# EAGLE design controller (EAGLE 6.2)
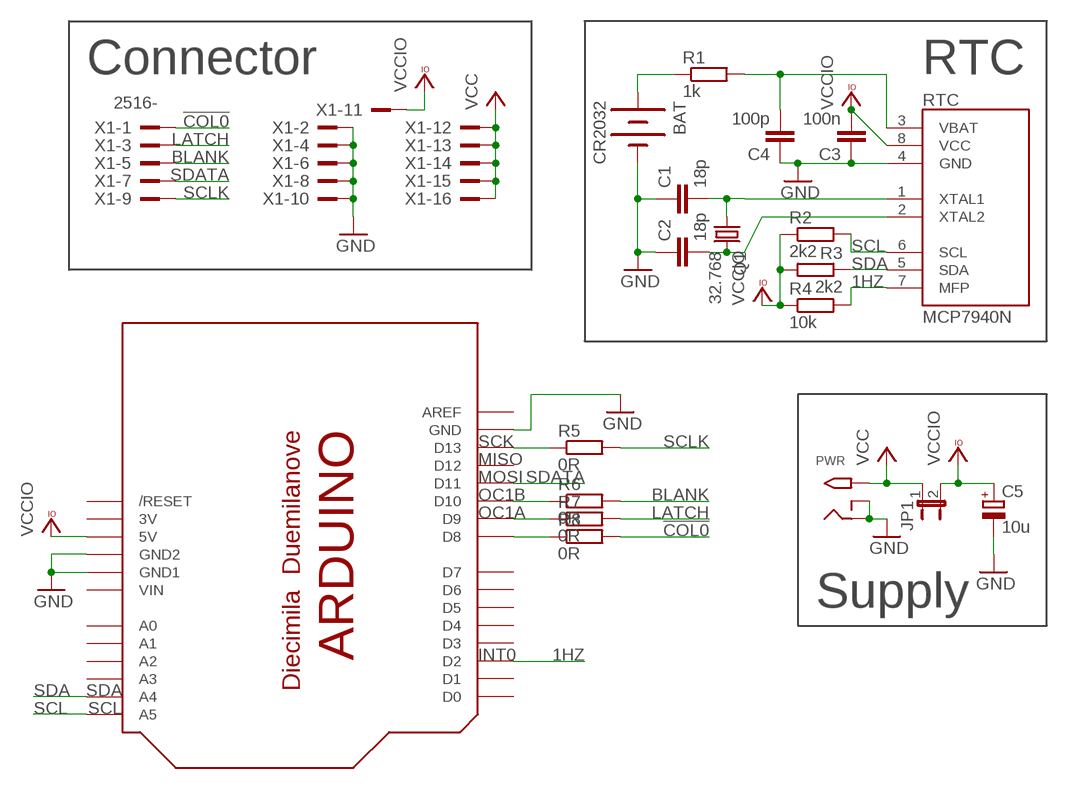
[diagram p0: schematic, sheet 1]

## Parts
ARDU  ARDUINODUEMILANOVE  [ARDUINO]
BAT  CR2032  [HAR-S8421]
C1  18p  C-EUC0603  [C0603]
C2  18p  C-EUC0603  [C0603]
C3  100n  C-EUC0603K  [C0603K]
C4  100p  C-EUC0603  [C0603]
C5  10u  CPOL-EUC/6032-28R  [C/6032-28R]
JP1  JP1E  [JP1]
PWR  2.1MMJACKTHM  [PJ-102A]
Q1  32.768  CRYSTALMM20SS  [MM20SS]
R1  1k  R-EU_R0603  [R0603]
R2  2k2  R-EU_R0603  [R0603]
R3  2k2  R-EU_R0603  [R0603]
R4  10k  R-EU_R0603  [R0603]
R5  0R  R-EU_R0603  [R0603]
R6  0R  R-EU_R0603  [R0603]
R7  0R  R-EU_R0603  [R0603]
R8  0R  R-EU_R0603  [R0603]
RTC  MCP7940N  [SO08]
X1  2516-  [PAK100/2500-16]

## Nets
1HZ: ARDU.D2 R4.2 RTC.7(MFP)
!COL0: R8.2 X1.1
BLANK: R6.2 X1.5
GND: ARDU.GND ARDU.GND1 ARDU.GND2 BAT.- C1.1 C2.1 C3.1 C4.1 C5.- PWR.RING PWR.RING_SW RTC.4(GND) X1.2 X1.4 X1.6 X1.8 X1.10
LATCH: R7.2 X1.3
N$1: C1.2 Q1.1 RTC.1(XTAL1)
N$2: C2.2 Q1.4 RTC.2(XTAL2)
N$3: BAT.+ R1.1
N$4: C4.2 R1.2 RTC.3(VBAT)
N$5: ARDU.D13 R5.1
N$6: ARDU.D10 R6.1
N$7: ARDU.D9 R7.1
N$8: ARDU.D8 R8.1
SCL: ARDU.A5 R2.2 RTC.6(SCL)
SCLK: R5.2 X1.9
SDA: ARDU.A4 R3.1 RTC.5(SDA)
SDATA: ARDU.D11 X1.7
VCC: JP1.1 PWR.TIP X1.12 X1.13 X1.14 X1.15 X1.16
VCCIO: ARDU.5V C3.2 C5.+ JP1.2 R2.1 R3.2 R4.1 RTC.8(VCC) X1.11
Unconnected: ARDU.A0 ARDU.A1 ARDU.A2 ARDU.A3 ARDU.AREF ARDU.D0 ARDU.D1 ARDU.D3 ARDU.D4 ARDU.D5 ARDU.D6 ARDU.D7 ARDU.D12 ARDU.RESET(/RESET)

## Notes on the sheet
- Connector
- RTC
- SCK
- MISO
- MOSI
- OC1B
- OC1A
- Supply
- INT0
- SDA
- SCL

## Power pins joined to a net without a drawn wire
3V: ARDU.3V
VIN: ARDU.VIN

## Library data of the parts
ARDU = adafruit:ARDUINO: Arduino Diecimila/Duemilanove Make a shield with ease, this package has all the named pins as well as the two mounting drill holes and an outline of the USB and DC power connector. The outline is on the DIMENSION layer, so if your board house uses it they will cut the outline to match. http://www.ladyada.net/library/pcb/eaglelibrary.html
BAT = jocki:CR2032
C1-C4 = rcl:C-EU: CAPACITOR, European symbol
C5 = rcl:CPOL-EU: POLARIZED CAPACITOR, European symbol
JP1 = jumper:JP1E: JUMPER
PWR = adafruit:2.1MMJACK: 2.1mm x 5.5mm THM DC jack with internal switch. Digikey part #PJ-102A, 4UCON part #05537 2.1mm x 5.5mm SMT DC jack with internal switch. Digikey part #PJ-002A-SMT, 4UCON part #03267 By microbuilder.eu & adafruit.com
Q1 = crystal:CRYSTAL: CRYSTAL; OC_FARNELL: unknown; OC_NEWARK: unknown
R1-R8 = rcl:R-EU_: RESISTOR, European symbol
RTC = jocki:MCP7940N
X1 = con-3m:2516-: 3M (TM) Pak 100 4-Wall Header Source: 3M; OC_FARNELL: unknown; OC_NEWARK: unknown

## Board
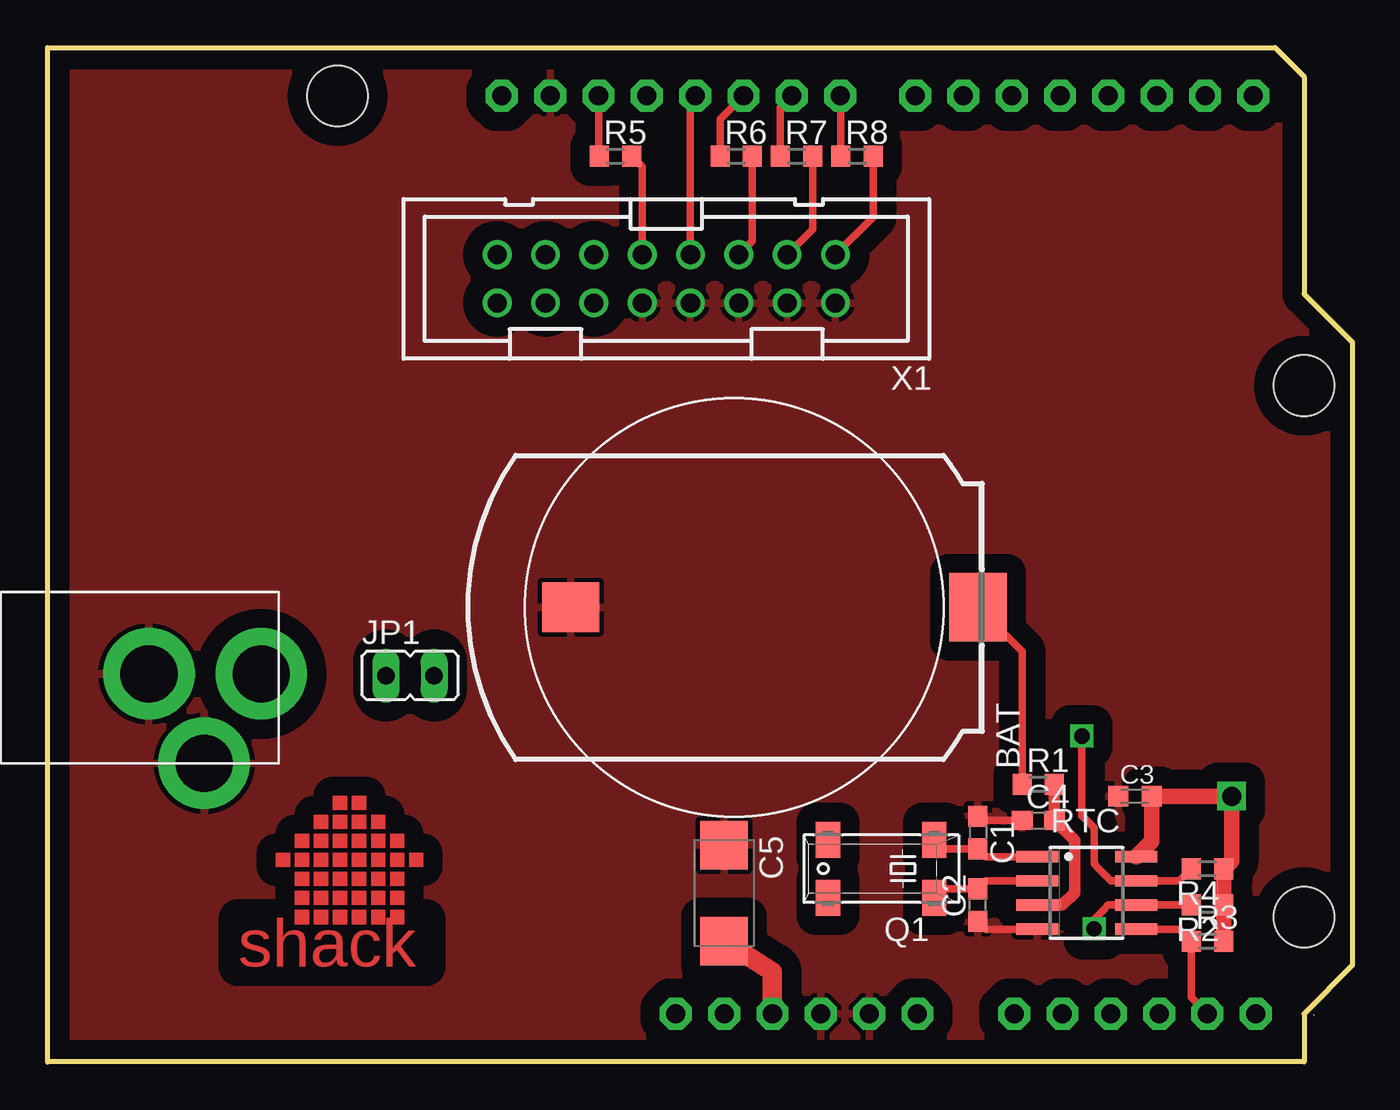
[diagram p1: board, top side]
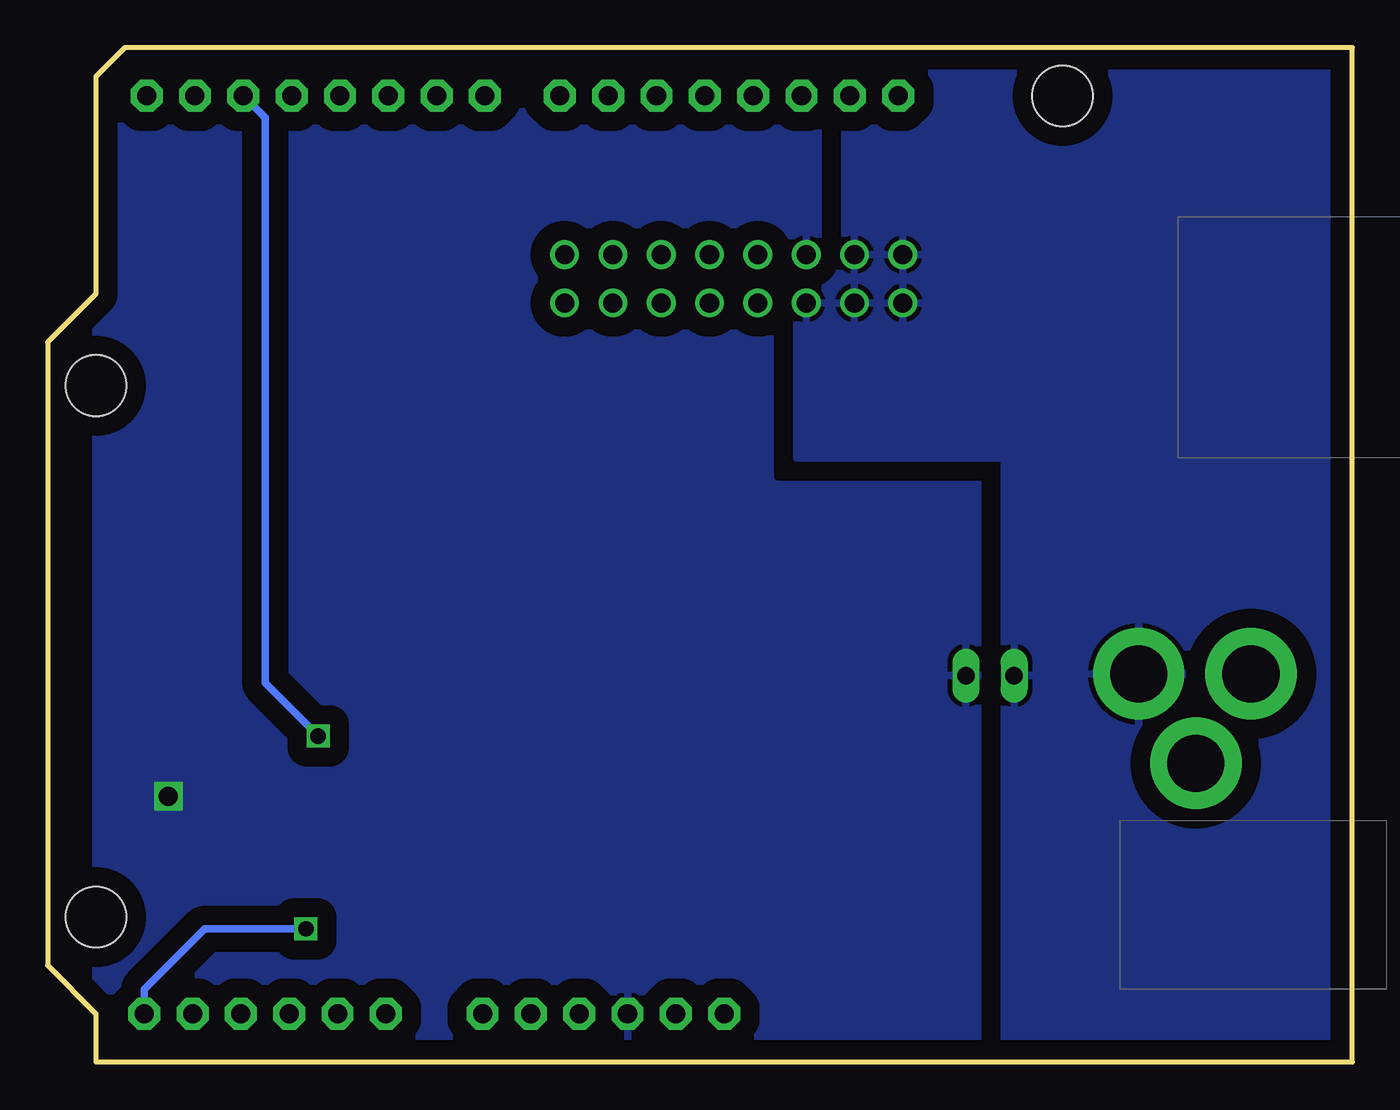
[diagram p2: board, bottom side, seen from below]

Size 68.58 x 53.34 mm. Coordinates in mm from the lower left corner, seen from the top.
Copper layers (1*16): Top 0.035mm / dielectric 1.5mm / Bottom 0.035mm
Design rules: minimum track width 10mil, minimum drill 24mil, track to track 8mil, track to pad 8mil, pad to pad 8mil, via to via 8mil, smd to smd 8mil, copper to edge 40mil, drill to drill 8mil, minimum pad ring 10mil, minimum via ring 8mil, stop-mask expansion 4mil, vias tented up to drill 0mil, thermal gap 10mil

### Footprints (pad centres in the part's own frame; a part is rotated, then mirrored left to right if it is on the bottom)
ARDUINO = drill 1 pad 1.676 octagon: 3V 35.56,2.54; 5V 38.1,2.54; A0 50.8,2.54; A1 53.34,2.54; A2 55.88,2.54; A3 58.42,2.54; A4 60.96,2.54; A5 63.5,2.54; AREF 23.876,50.8; D0 63.373,50.8; D1 60.833,50.8; D2 58.293,50.8; D3 55.753,50.8; D4 53.213,50.8; D5 50.673,50.8; D6 48.133,50.8; D7 45.593,50.8; D8 41.656,50.8; D9 39.116,50.8; D10 36.576,50.8; D11 34.036,50.8; D12 31.496,50.8; D13 28.956,50.8; GND 26.416,50.8; GND1 43.18,2.54; GND2 40.64,2.54; RESET 33.02,2.54; VIN 45.72,2.54 | hole 3.2: 66.04,35.56; 66.04,7.62; 15.24,50.8
HAR-S8421 = smd 3.6 x 3: + 0,-12.8 | smd 2.6 x 3: - 0,8.6
C0603 = smd 1.1 x 1: 1 -0.85,0; 2 0.85,0
C0603K = smd 1.05 x 1.08: 1 -0.875,0; 2 0.875,0
C/6032-28R = smd 2.55 x 2.5: + 2.525,0; - -2.525,0
JP1 = drill 0.914 long: 1 0,-1.27; 2 0,1.27
PJ-102A = drill 3 pad 4.8: RING 0.1,-3.39; RING_SW -4.6,-6.29; TIP 0.1,-9.29
MM20SS = smd 1.27 x 1.88: 1 -2.794,-1.524; 2 2.794,-1.524; 3 2.794,1.524; 4 -2.794,1.524
R0603 = smd 1 x 1.1: 1 -0.85,0; 2 0.85,0
SO08 = smd 0.6 x 2.2: 1 -1.905,-2.6; 2 -0.635,-2.6; 3 0.635,-2.6; 4 1.905,-2.6; 5 1.905,2.6; 6 0.635,2.6; 7 -0.635,2.6; 8 -1.905,2.6
PAK100/2500-16 = drill 1 pad 1.422: 1 -8.89,-1.27; 2 -8.89,1.27; 3 -6.35,-1.27; 4 -6.35,1.27; 5 -3.81,-1.27; 6 -3.81,1.27; 7 -1.27,-1.27; 8 -1.27,1.27; 9 1.27,-1.27; 10 1.27,1.27; 11 3.81,-1.27; 12 3.81,1.27; 13 6.35,-1.27; 14 6.35,1.27; 15 8.89,-1.27; 16 8.89,1.27

### Placement (x,y rotation side)
ARDU  0,0 0 top
BAT  36.1,23.9 90 top
C1  48.9,12.06 270 top
C2  48.9,8.26 90 top
C3  57.15,13.97 0 top
C4  52.07,12.7 0 top
C5  35.56,8.89 270 top
JP1  19.05,20.32 270 top
PWR  1.94,20.31 90 top
Q1  43.81,10.16 180 top
R1  52.07,14.61 0 top
R2  60.96,8.26 180 top
R3  60.96,6.35 0 top
R4  60.96,10.16 180 top
R5  29.84,47.62 0 top
R6  36.2,47.62 0 top
R7  39.37,47.62 0 top
R8  42.55,47.62 0 top
RTC  54.61,8.89 270 top
X1  32.52,41.18 180 top

### Tracks (layer width: path | path; a pad name or v marks a point on that pad's centre or on a via)
1HZ  (via drill 0.8)
  Top 0.406: R4.2 59.48,9.53 RTC.7 55.88,9.53 55.24,10.16 55,10.4 55,12.31 54.61,12.7 54.37,12.95 v54.37,17.14
  Bottom 0.406: v54.37,17.14 57.15,19.92 57.15,24.13 57.15,49.66 ARDU.D2
!COL0
  Top 0.406: R8.2 43.4,44.44 X1.1
BLANK
  Top 0.406: R6.2 37.05,43.16 X1.5
GND
  Top 0.406: C2.1 49.31,6.99 RTC.4 | C4.1 49.95,12.7 49.11,12.7 C1.1
  pour Top (isolate 1.016, rank 2): 66.17,0 66.17,2.54 68.72,5.08 68.72,37.85 66.17,40.39 66.17,51.69 64.52,53.34 0,53.34 0,0
LATCH
  Top 0.406: R7.2 40.22,43.8 X1.3
N$1
  Top 0.406: RTC.1 49.31,10.79 C1.2 47.08,11.21 Q1.1
N$2
  Top 0.406: RTC.2 49.31,9.53 C2.2 47.08,9.11 Q1.4
N$3
  Top 0.406: R1.1 51.22,21.58 BAT.+
N$4
  Top 0.61: RTC.3 53.34,8.26 53.98,8.89 53.98,11.64 C4.2 R1.2
N$5
  Top 0.406: ARDU.D13 28.96,47.66 R5.1
N$6
  Top 0.406: R6.1 35.34,49.57 ARDU.D10
N$7
  Top 0.406: R7.1 38.52,50.2 ARDU.D9
N$8
  Top 0.406: R8.1 41.7,50.76 ARDU.D8
SCL  (via drill 0.8)
  Top 0.406: 58.42,8.26 RTC.6 55.76,8.26 55.5,8 55,7.5 v55,7 | 58.42,8.26 59.05,8.26 | 59.05,8.26 R2.2 60.33,8.26 | 59.05,8.26 58.42,8.26
  Bottom 0.406: ARDU.A5 63.5,3.81 60.31,7 v55,7
SCLK
  Top 0.406: X1.9 31.25,47.07 R5.2
SDA
  Top 0.406: RTC.5 59.48,6.99 R3.1 60.11,4.03 60.11,3.39 ARDU.A4
SDATA
  Top 0.406: X1.7 33.79,50.55 ARDU.D11
VCC
  pour Bottom (isolate 1.016): 0,0 18.3,0 18.3,31.75 29.21,31.75 29.21,39.73 26.67,42.27 26.67,53.34 0,53.34
VCCIO  (via drill 1)
  Top 0.813: R3.2 R2.1 R4.1 62.23,10.58 v62.23,13.97 C3.2 58.02,11.61 RTC.8
  Top 1.016: C5.+ 38.1,4.75 ARDU.5V
  pour Bottom (isolate 1.016, rank 2): 18.3,0 66.04,0 66.04,53.34 26.67,53.34 26.67,42.27 29.21,39.73 29.21,31.75 18.3,31.75
(copper drawn outside any net)
  shapes: Top area x38

### Text on the board
Top: shack